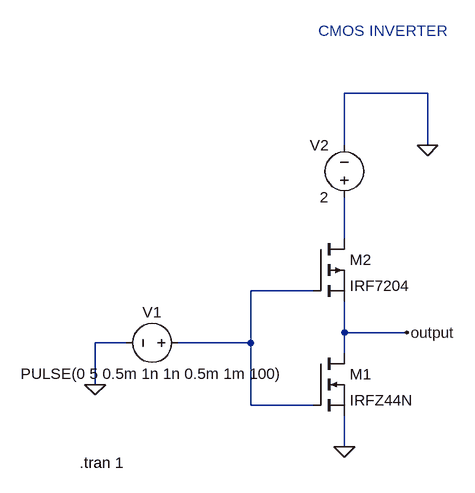
[diagram p0: schematic 16)cmos_inverter.asc]
16)cmos_inverter.asc, the LTspice schematic file:
Version 4
SHEET 1 880 680
WIRE 384 -208 256 -208
WIRE 256 -128 256 -208
WIRE 384 -128 384 -208
WIRE 256 16 256 -48
WIRE 208 96 112 96
WIRE 256 160 256 112
WIRE 352 160 256 160
WIRE -80 176 -128 176
WIRE 112 176 112 96
WIRE 112 176 0 176
WIRE 256 192 256 160
WIRE -128 240 -128 176
WIRE 112 272 112 176
WIRE 208 272 112 272
WIRE 256 336 256 288
FLAG 256 336 0
FLAG -128 240 0
FLAG 384 -128 0
FLAG 352 160 output
SYMBOL nmos 208 192 R0
SYMATTR InstName M1
SYMATTR Value IRFZ44N
SYMBOL pmos 208 16 R0
SYMATTR InstName M2
SYMATTR Value IRF7204
SYMBOL voltage 16 176 R90
WINDOW 0 -32 56 VBottom 2
WINDOW 3 32 56 VTop 2
WINDOW 123 0 0 Left 0
WINDOW 39 0 0 Left 0
SYMATTR InstName V1
SYMATTR Value PULSE(0 5 0.5m 1n 1n 0.5m 1m 100)
SYMBOL voltage 256 -32 R180
WINDOW 0 24 96 Left 2
WINDOW 3 24 16 Left 2
WINDOW 123 0 0 Left 0
WINDOW 39 0 0 Left 0
SYMATTR InstName V2
SYMATTR Value 2
TEXT -152 360 Left 2 !.tran 1
TEXT 216 -304 Left 2 ;CMOS INVERTER

The netlist it stands for:
* 16)cmos_inverter.asc
M1 output N002 0 0 IRFZ44N
M2 N001 N002 output output IRF7204
V1 N002 0 PULSE(0 5 0.5m 1n 1n 0.5m 1m 100)
V2 N001 0 2
.model NMOS NMOS
.model PMOS PMOS
.lib standard.mos
.tran 1
* CMOS INVERTER
.backanno
.end